# EAGLE design NES (EAGLE 9.6.2)
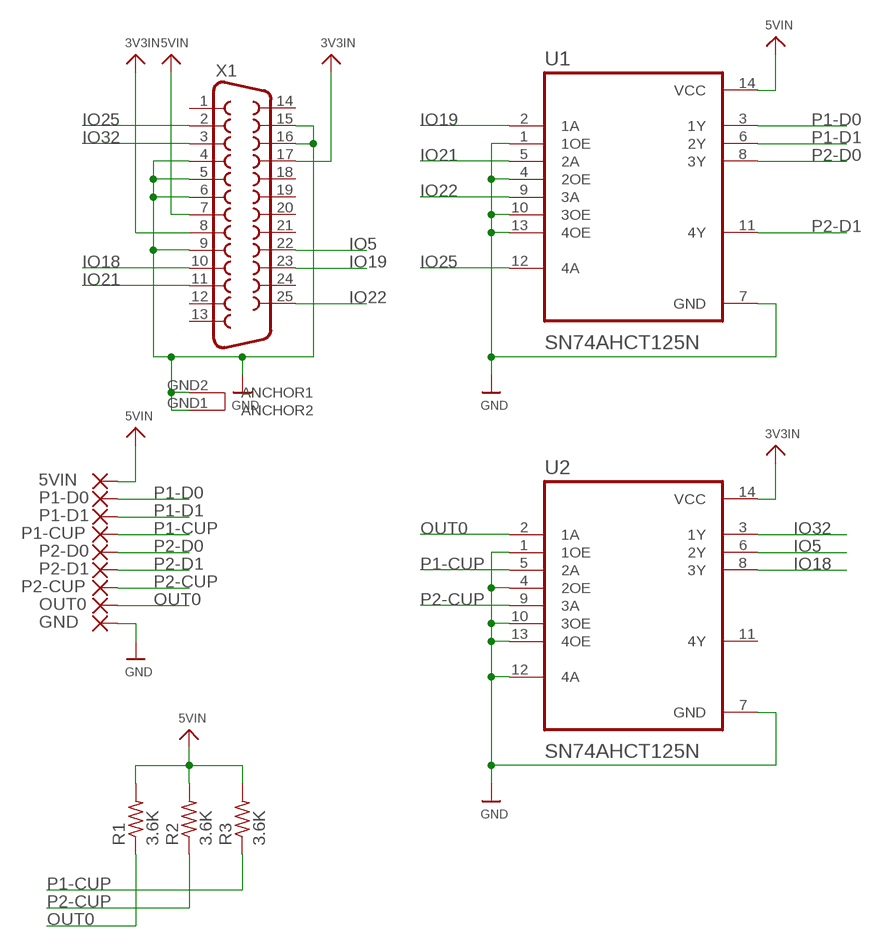
[diagram p0: schematic, sheet 1]

## Parts
5VIN  SMD5  [SMD2,54-5,08]
GND  SMD5  [SMD2,54-5,08]
OUT0  SMD5  [SMD2,54-5,08]
P1-CUP  SMD5  [SMD2,54-5,08]
P1-D0  SMD5  [SMD2,54-5,08]
P1-D1  SMD5  [SMD2,54-5,08]
P2-CUP  SMD5  [SMD2,54-5,08]
P2-D0  SMD5  [SMD2,54-5,08]
P2-D1  SMD5  [SMD2,54-5,08]
R1  3.6K  R-US_R1206  [R1206]
R2  3.6K  R-US_R1206  [R1206]
R3  3.6K  R-US_R1206  [R1206]
U1  SN74AHCT125N  [DIP794W45P254L1969H508Q14]
U2  SN74AHCT125N  [DIP794W45P254L1969H508Q14]
X1  DB25_FEMALEHP  [F25HP]

## Nets
3V3IN: U2.14(VCC) X1.8 X1.17
5VIN: 5VIN.1(P) R1.2 R2.2 R3.2 U1.14(VCC) X1.7
GND: GND.1(P) U1.1(1OE) U1.4(2OE) U1.7(GND) U1.10(3OE) U1.13(4OE) U2.1(1OE) U2.4(2OE) U2.7(GND) U2.10(3OE) U2.12(4A) U2.13(4OE) X1.4 X1.5 X1.6 X1.9 X1.15 X1.16 X1.GND1(ANCHOR2) X1.GND2(ANCHOR1)
IO5: U2.6(2Y) X1.22
IO18: U2.8(3Y) X1.10
IO19: U1.2(1A) X1.23
IO21: U1.5(2A) X1.11
IO22: U1.9(3A) X1.25
IO25: U1.12(4A) X1.2
IO32: U2.3(1Y) X1.3
OUT0: OUT0.1(P) R1.1 U2.2(1A)
P1-CUP: P1-CUP.1(P) R3.1 U2.5(2A)
P1-D0: P1-D0.1(P) U1.3(1Y)
P1-D1: P1-D1.1(P) U1.6(2Y)
P2-CUP: P2-CUP.1(P) R2.1 U2.9(3A)
P2-D0: P2-D0.1(P) U1.8(3Y)
P2-D1: P2-D1.1(P) U1.11(4Y)
Unconnected: U2.11(4Y) X1.1 X1.12 X1.13 X1.14 X1.18 X1.19 X1.20 X1.21 X1.24

## Library data of the parts
5VIN GND OUT0 P1-CUP P1-D0 P1-D1 P2-CUP P2-D0 P2-D1 = wirepad:SMD5: SMD PAD
R1-R3 = adafruit:R-US_: RESISTOR, American symbol
U1 U2 = SN74AHCT125N:SN74AHCT125N: None Check prices <https://pricing.snapeda.com/parts/SN74AHCT125N/Texas%20Instruments/view-part?ref=eda>; AVAILABILITY: In Stock; DESCRIPTION: Quadruple Bus Buffer Gates With 3-State Outputs 14-PDIP -40 to 125; MF: Texas Instruments; MP: SN74AHCT125N; PACKAGE: PDIP-14 Texas Instruments; PRICE: None; PURCHASE-URL: https://pricing.snapeda.com/search/part/SN74AHCT125N/?ref=eda
X1 = SparkFun-Retired:DB25_FEMALE: 25 Pin male connector. PCB edge mount for regular PCB thicknesses. This connector will connect directly to the back of a PC parallel port or through a normal DB25 extension cable (M/F). SKU: PRT-08287

## Board
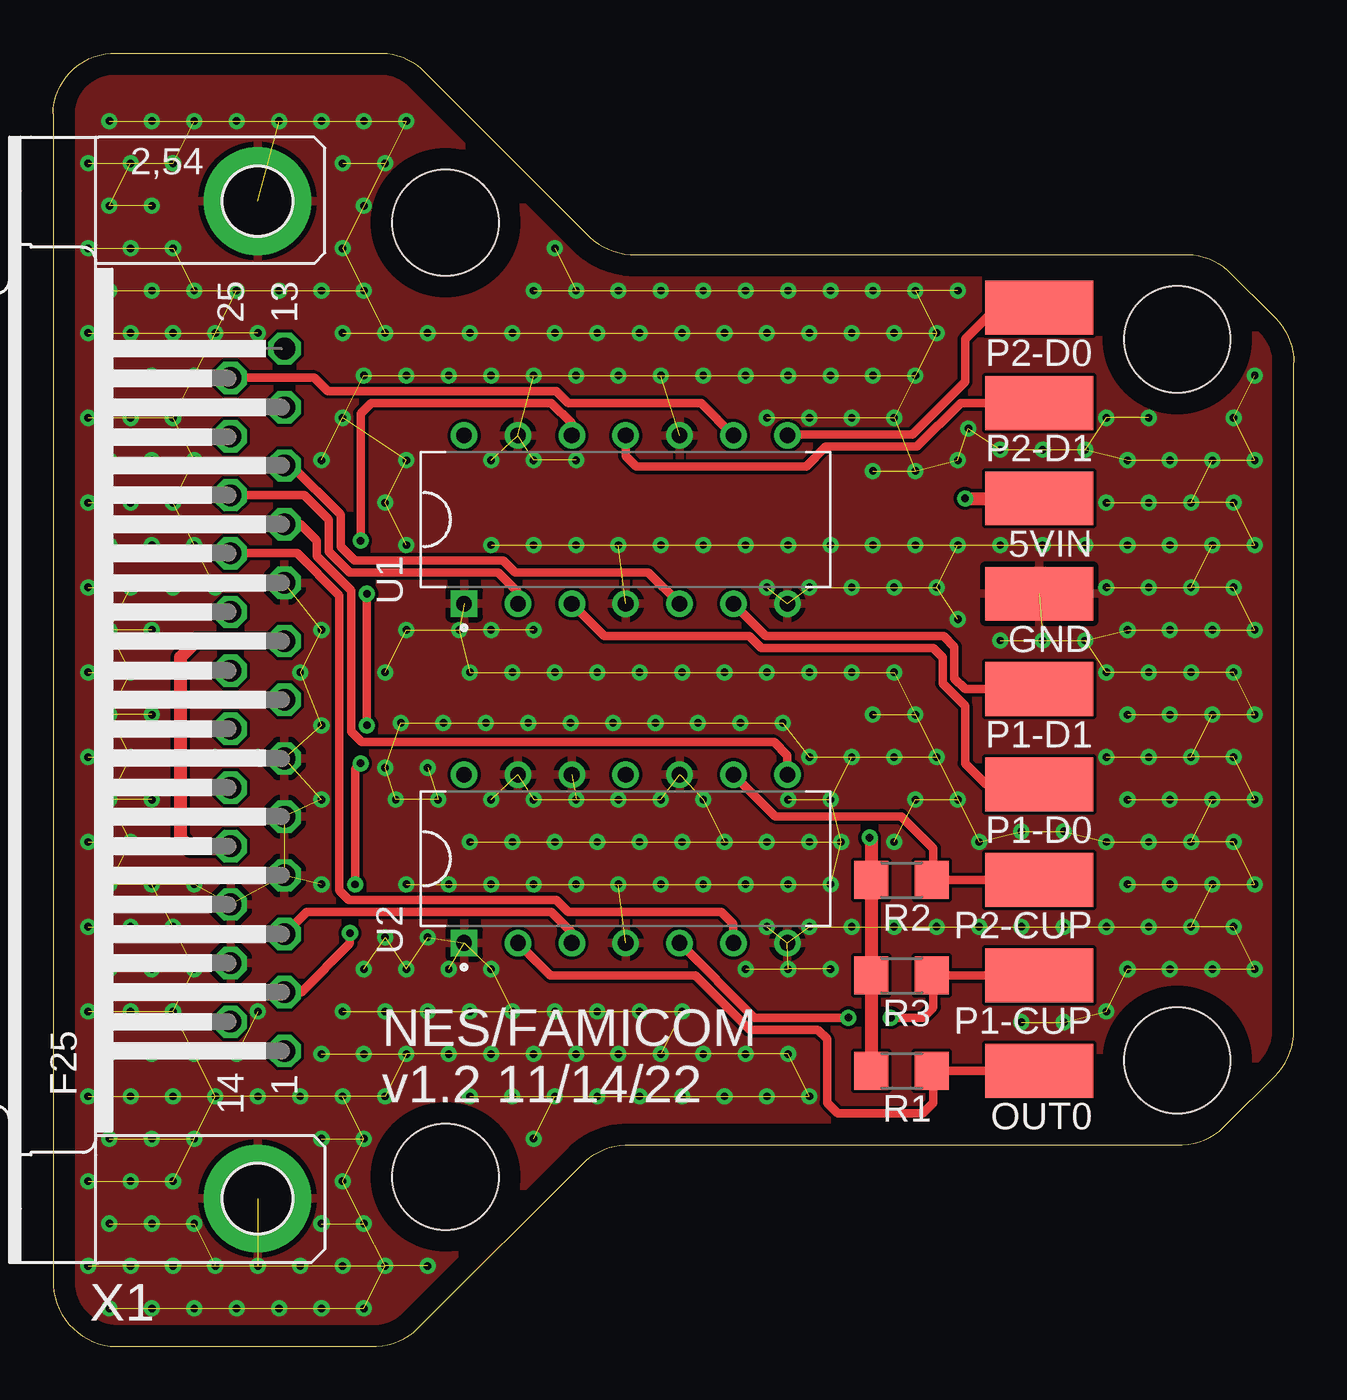
[diagram p1: board, top side]
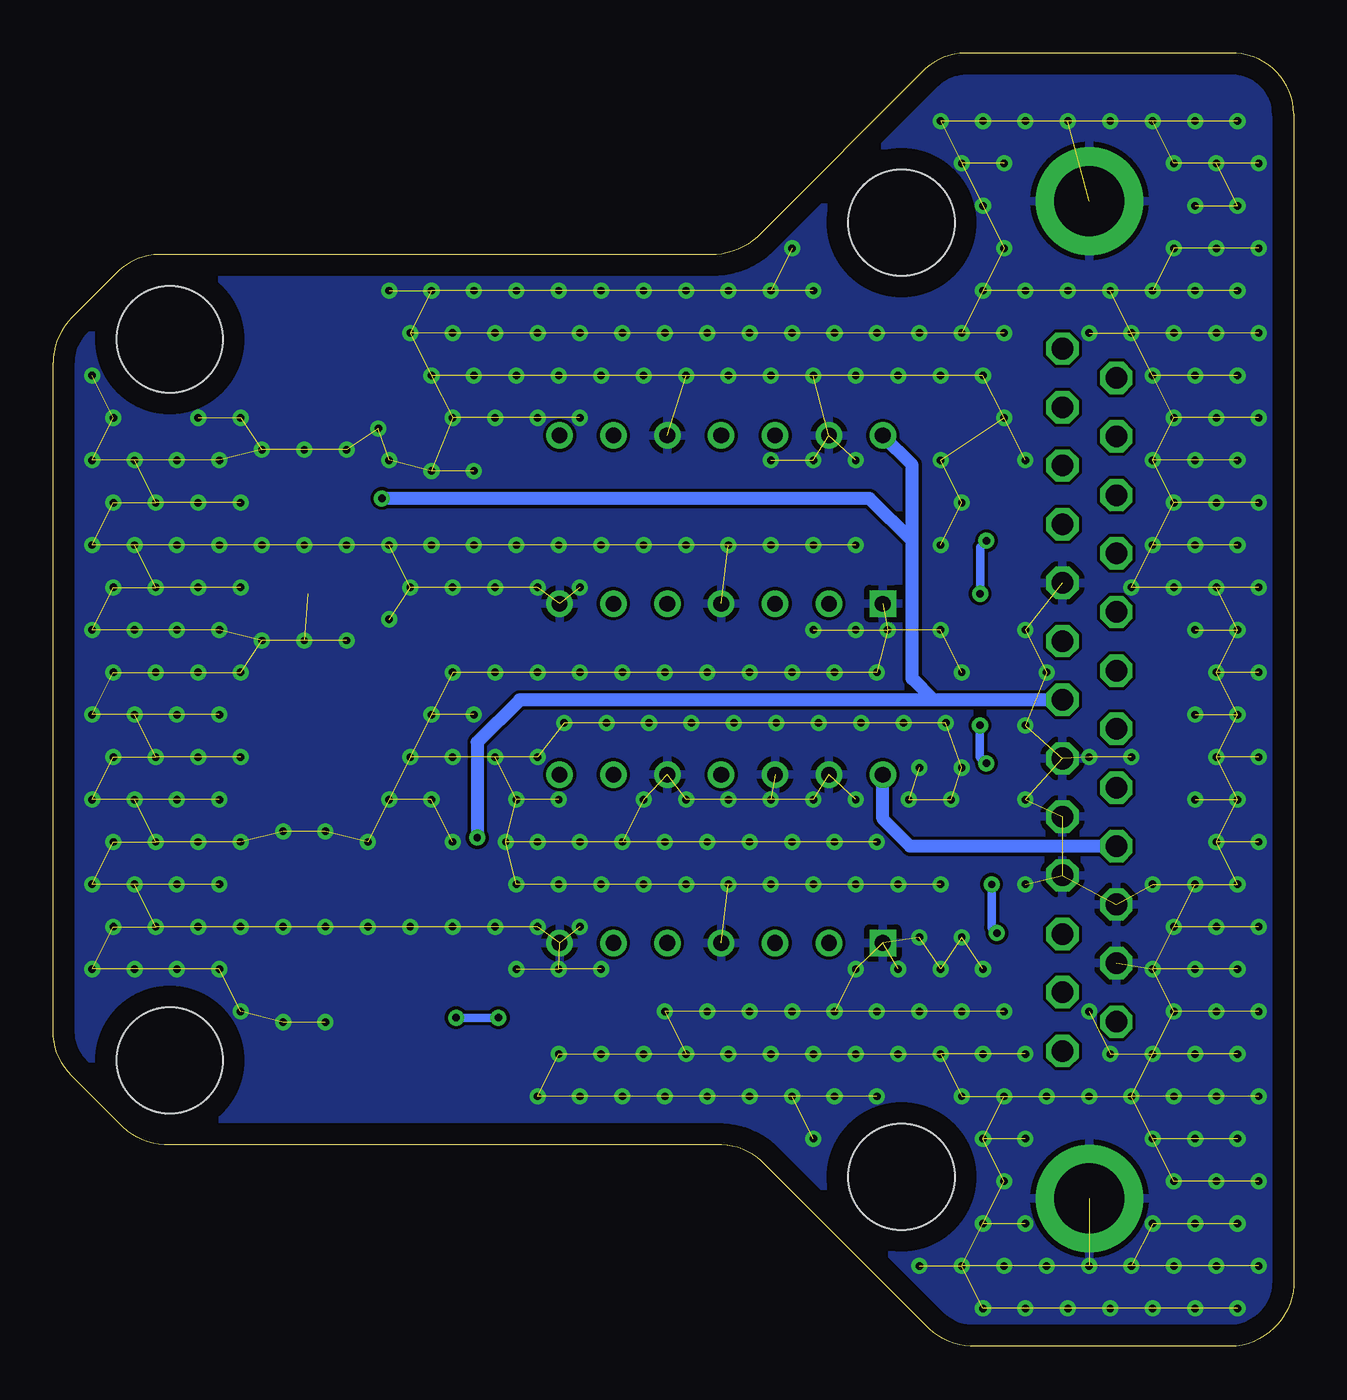
[diagram p2: board, bottom side, seen from below]

Size 58.5 x 61 mm. Coordinates in mm from the lower left corner, seen from the top.
Outline: 0,58.14 0,3.14 arc90 2.99,0 15.25,0 arc45 17.37,1.02 25.11,8.76 arc-45 27.23,9.5 53.25,9.5 arc45 55.37,10.52 57.61,12.76 arc45 58.5,14.88 58.5,46.4 arc45 57.61,48.52 55.37,50.76 arc45 53.25,51.5 27.23,51.5 arc-45 25.11,52.52 17.37,60.26 arc45 15.25,61 2.99,61 arc90 0,58.14
Copper layers (1*16): Top 0.035mm / dielectric 1.5mm / Bottom 0.035mm
Design rules "default": minimum track width 6mil, minimum drill 0.35mm, track to track 6mil, track to pad 6mil, pad to pad 6mil, via to via 6mil, smd to smd 6mil, copper to edge 40mil, drill to drill 6mil, minimum pad ring 10mil, minimum via ring 8mil, stop-mask expansion 4mil, vias tented up to drill 0.5mm, thermal gap 10mil
Holes 5 mm at 53,13.5 53,47.5 18.5,53 18.5,8

### Footprints (pad centres in the part's own frame; a part is rotated, then mirrored left to right if it is on the bottom)
SMD2,54-5,08 = smd 2.54 x 5.08: 1 0,0
R1206 = smd 1.6 x 1.803: 1 -1.422,0; 2 1.422,0
DIP794W45P254L1969H508Q14 = drill 0.74 pad 1.14 square: 1 -3.97,7.62 | drill 0.74 pad 1.14: 2 -3.97,5.08; 3 -3.97,2.54; 4 -3.97,0; 5 -3.97,-2.54; 6 -3.97,-5.08; 7 -3.97,-7.62; 8 3.97,-7.62; 9 3.97,-5.08; 10 3.97,-2.54; 11 3.97,0; 12 3.97,2.54; 13 3.97,5.08; 14 3.97,7.62
F25HP = drill 1.016 octagon: 1 -16.561,-1.27; 2 -13.792,-1.27; 3 -11.049,-1.27; 4 -8.28,-1.27; 5 -5.512,-1.27; 6 -2.769,-1.27; 7 0,-1.27; 8 2.769,-1.27; 9 5.512,-1.27; 10 8.28,-1.27; 11 11.049,-1.27; 12 13.792,-1.27; 13 16.561,-1.27; 14 -15.189,1.27; 15 -12.421,1.27; 16 -9.652,1.27; 17 -6.909,1.27; 18 -4.14,1.27; 19 -1.372,1.27; 20 1.372,1.27; 21 4.14,1.27; 22 6.909,1.27; 23 9.652,1.27; 24 12.421,1.27; 25 15.189,1.27 | drill 3.302 pad 5.08: GND1 -23.52,0; GND2 23.52,0

### Placement (x,y rotation side)
5VIN  46.5,40 90 top
GND  46.5,35.5 90 top
OUT0  46.5,13 90 top
P1-CUP  46.5,17.5 90 top
P1-D0  46.5,26.5 90 top
P1-D1  46.5,31 90 top
P2-CUP  46.5,22 90 top
P2-D0  46.5,49 90 top
P2-D1  46.5,44.5 90 top
R1  40,13 180 top
R2  40,22 180 top
R3  40,17.5 180 top
U1  27,39 90 top
U2  27,23 90 top
X1  9.64,30.5 90 top

### Tracks (layer width: path | path; a pad name or v marks a point on that pad's centre or on a via)
3V3IN
  Top 0.61: X1.8 6.77,33.27 6,32.5 6,24 6.5,23.5 8.28,23.5 X1.17
  Bottom 0.61: X1.17 18.09,23.59 19.38,24.88 U2.14
5VIN  (via drill 0.35)
  Top 0.61: v43,40 5VIN.1 | v38.5,24 38.58,23.92 R2.2 R3.2 R1.2
  Bottom 0.61: X1.7 17,30.5 | U1.14 18,41.59 18,38 | 17,30.5 18,31.5 18,38 | 18,38 20,40 v43,40 | 17,30.5 36.5,30.5 38.5,28.5 v38.5,24
GND  (via drill 0.35)  (406 unrouted)
  other vias: 2.66,1.8 1.66,3.8 2.66,5.8 1.66,7.8 2.66,9.8 1.66,11.8 2.66,13.8 1.66,15.8 2.66,17.8 1.66,19.8 2.66,21.8 1.66,23.8 2.66,25.8 1.66,27.8 2.66,29.8 1.66,31.8 2.66,33.8 1.66,35.8 2.66,37.8 1.66,39.8 2.66,41.8 1.66,43.8 2.66,45.8 1.66,47.8 2.66,49.8 1.66,51.8 2.66,53.8 1.66,55.8 2.66,57.8 4.66,1.8 3.66,3.8 4.66,5.8 3.66,7.8 4.66,9.8 3.66,11.8 4.66,13.8 3.66,15.8 4.66,17.8 3.66,19.8 4.66,21.8 3.66,23.8 4.66,25.8 3.66,27.8 4.66,29.8 3.66,31.8 4.66,33.8 3.66,35.8 4.66,37.8 3.66,39.8 4.66,41.8 3.66,43.8 4.66,45.8 3.66,47.8 4.66,49.8 3.66,51.8 4.66,53.8 3.66,55.8 4.66,57.8 6.66,1.8 5.66,3.8 6.66,5.8 5.66,7.8 6.66,9.8 5.66,11.8 6.66,13.8 5.66,15.8 6.66,17.8 5.66,19.8 6.66,21.8 5.66,35.8 6.66,37.8 5.66,39.8 6.66,41.8 5.66,43.8 6.66,45.8 5.66,47.8 6.66,49.8 5.66,51.8 5.66,55.8 6.66,57.8 8.66,1.8 7.66,3.8 7.66,11.8 8.66,13.8 7.66,27.8 7.66,35.8 7.66,47.8 8.66,49.8 8.66,57.8 10.66,1.8 9.66,3.8 9.66,11.8 9.66,15.8 9.66,27.8 9.66,47.8 10.66,49.8 10.66,57.8 12.66,1.8 11.66,3.8 12.66,5.8 12.66,9.8 11.66,11.8 12.66,13.8 12.66,21.8 12.66,25.8 12.66,29.3 11.66,31.8 12.66,33.8 12.66,41.8 12.66,49.8 12.66,57.8 14.66,1.8 13.66,3.8 14.66,5.8 13.66,7.8 14.66,9.8 13.66,11.8 14.66,13.8 13.66,15.8 14.66,17.8 13.66,43.8 14.66,45.8 13.66,47.8 14.66,49.8 13.66,51.8 14.66,53.8 13.66,55.8 14.66,57.8 15.66,3.8 15.66,11.8 16.66,13.8 15.66,15.8 16.66,17.8 15.66,19.3 16.66,21.8 16.16,25.8 15.66,27.3 16.4,29.42 15.66,31.8 16.66,33.8 16.66,37.8 15.66,39.8 16.66,41.8 16.66,45.8 15.66,47.8 15.66,55.8 16.66,57.8 17.66,3.8 18.66,13.8 17.66,15.8 18.66,17.8 17.66,19.3 18.66,21.8 18.16,25.8 17.66,27.3 18.4,29.42 19.16,33.8 18.66,45.8 17.66,47.8 19.66,11.8 20.66,13.8 19.66,15.8 20.66,17.8 20.66,21.8 19.66,23.8 20.66,25.8 20.4,29.42 19.66,31.8 20.66,33.8 20.66,37.8 20.66,41.8 20.66,45.8 19.66,47.8 22.66,9.8 21.66,11.8 22.66,13.8 21.66,15.8 22.66,21.8 21.66,23.8 22.66,25.8 22.4,29.42 21.66,31.8 22.66,33.8 22.66,37.8 22.66,41.8 22.66,45.8 21.66,47.8 22.66,49.8 23.66,11.8 24.66,13.8 23.66,15.8 24.66,21.8 23.66,23.8 24.66,25.8 24.4,29.42 23.66,31.8 24.66,37.8 24.66,41.8 24.66,45.8 23.66,47.8 24.66,49.8 23.66,51.8 25.66,11.8 26.66,13.8 25.66,15.8 26.66,21.8 25.66,23.8 26.66,25.8 26.4,29.42 25.66,31.8 26.66,37.8 26.66,45.8 25.66,47.8 26.66,49.8 27.66,11.8 28.66,13.8 27.66,15.8 28.66,21.8 27.66,23.8 28.66,25.8 28.4,29.42 27.66,31.8 28.66,37.8 28.66,45.8 27.66,47.8 28.66,49.8 29.66,11.8 30.66,13.8 29.66,15.8 30.66,21.8 29.66,23.8 30.66,25.8 30.4,29.42 29.66,31.8 30.66,37.8 30.66,45.8 29.66,47.8 30.66,49.8 31.66,11.8 32.66,13.8 32.66,17.8 32.66,21.8 31.66,23.8 32.4,29.42 31.66,31.8 32.66,37.8 32.66,45.8 31.66,47.8 32.66,49.8 33.66,11.8 34.66,13.8 34.66,17.8 33.66,19.8 34.66,21.8 33.66,23.8 34.66,25.8 34.4,29.42 33.66,31.8 33.66,35.8 34.66,37.8 33.66,43.8 34.66,45.8 33.66,47.8 34.66,49.8 35.66,11.8 36.66,17.8 35.66,19.8 36.66,21.8 35.66,23.8 36.66,25.8 35.66,27.8 35.66,31.8 35.66,35.8 36.66,37.8 35.66,43.8 36.66,45.8 35.66,47.8 36.66,49.8 37.66,19.8 37.16,23.8 37.66,27.8 38.66,29.8 37.66,31.8 37.66,35.8 38.66,37.8 38.66,41.3 37.66,43.8 38.66,45.8 37.66,47.8 38.66,49.8 39.66,19.8 39.66,23.8 40.66,25.8 39.66,27.8 40.66,29.8 39.66,31.8 39.66,35.8 40.66,37.8 40.66,41.3 39.66,43.8 40.66,45.8 39.66,47.8 40.66,49.8 41.66,19.8 42.66,25.8 41.66,27.8 42.66,34.3 41.66,35.8 42.66,37.8 42.66,41.8 41.66,47.8 42.66,49.8 43.66,19.8 43.66,23.8 44.66,33.3 44.66,37.8 44.66,42.3 43.16,43.3 45.66,15.3 45.66,19.8 45.66,24.3 46.66,33.3 46.66,37.8 46.66,42.3 47.66,15.3 47.66,19.8 47.66,24.3 48.66,33.3 48.66,37.8 48.66,42.3 49.66,15.8 50.66,17.8 49.66,19.8 50.66,21.8 49.66,23.8 50.66,25.8 49.66,27.8 50.66,29.8 49.66,31.8 50.66,33.8 49.66,35.8 50.66,37.8 49.66,39.8 50.66,41.8 49.66,43.8 52.66,17.8 51.66,19.8 52.66,21.8 51.66,23.8 52.66,25.8 51.66,27.8 52.66,29.8 51.66,31.8 52.66,33.8 51.66,35.8 52.66,37.8 51.66,39.8 52.66,41.8 51.66,43.8 54.66,17.8 53.66,19.8 54.66,21.8 53.66,23.8 54.66,25.8 53.66,27.8 54.66,29.8 53.66,31.8 54.66,33.8 53.66,35.8 54.66,37.8 53.66,39.8 54.66,41.8 56.66,17.8 55.66,19.8 56.66,21.8 55.66,23.8 56.66,25.8 55.66,27.8 56.66,29.8 55.66,31.8 56.66,33.8 55.66,35.8 56.66,37.8 55.66,39.8 56.66,41.8 55.66,43.8 56.66,45.8
  pour Top: 0,0 0,61 28.49,61 28.49,51.64 58.99,51.64 58.99,9.5 27.99,9.5 27.99,0
  pour Bottom: 0,0 0,61 28.49,61 28.49,51.64 58.99,51.64 58.99,9.5 27.99,9.5 27.99,0
IO5
  Top 0.406: U2.6 32.08,19.92 31.5,20.5 24.29,20.5 23.73,21.06 13.94,21.06 13.5,21.5 13.5,35.42 11.51,37.41 X1.22
IO18
  Top 0.406: U2.8 34.62,27.88 34,28.5 14.56,28.5 14.06,29 14.06,35.65 12.44,37.27 12.44,38 11.66,38.78 X1.10
IO19
  Top 0.406: U1.2 21.92,35.58 21,36.5 14,36.5 13,37.5 13,39 11.85,40.15 X1.23
IO21
  Top 0.406: U1.5 28.07,36.5 21.79,36.5 21.23,37.06 14.23,37.06 13.56,37.73 13.56,39.23 11.24,41.55 X1.11
IO22
  Top 0.406: U1.9 30.55,44.5 24.29,44.5 23.73,45.06 12.94,45.06 12.31,45.69 X1.25
IO25  (via drill 0.35)
  Top 0.406: U1.12 24.46,43.54 23.5,44.5 15,44.5 14.5,44 v14.5,38 | v14.79,35.5 v14.79,29.3 v14.8,29.3 | v14.5,27.5 14.24,27.25 v14.24,21.79 | v14,19.5 14,19 11.71,16.71 X1.2
  Bottom 0.406: v14.5,38 14.79,37.71 v14.79,35.5 | v14.8,29.3 14.8,27.8 v14.5,27.5 | v14.24,21.79 14.24,19.75 v14,19.5
IO32
  Top 0.406: U2.3 24.46,19.54 23.5,20.5 11.96,20.5 X1.3
OUT0
  Top 0.406: OUT0.1 R1.1 41.5,12.92 41.5,11.5 41,11 37,11 36.5,11.5 36.5,14.5 36.06,14.94 32.84,14.94 30.28,17.5 23.45,17.5 U2.2
P1-CUP  (via drill 0.35)
  Top 0.406: P1-CUP.1 R3.1 41.5,17.42 41.5,16 41,15.5 v39.5,15.5 | U2.5 33.07,15.5 v37.5,15.5
  Bottom 0.406: v37.5,15.5 v39.5,15.5
P1-D0
  Top 0.406: U1.3 25.99,33.5 32.82,33.5 33.38,32.94 41.5,32.94 41.94,32.5 41.94,31.27 43,30.21 43,27.5 44,26.5 P1-D0.1
P1-D1
  Top 0.406: U1.6 33.61,33.5 42,33.5 42.5,33 42.5,31.5 43,31 P1-D1.1
P2-CUP
  Top 0.406: R2.1 41.5,22 | 41.5,22 P2-CUP.1 | U2.9 34.05,25 40,25 41.5,23.5 41.5,22
P2-D0
  Top 0.406: P2-D0.1 44.5,49 43,47.5 43,45.5 40.5,43 34.65,43 U1.8
P2-D1
  Top 0.406: U1.11 27,42 27.5,41.5 35.5,41.5 36.44,42.44 40.73,42.44 42.79,44.5 P2-D1.1

### Text on the board
tPlace: NES/FAMICOM / v1.2 11/14/22